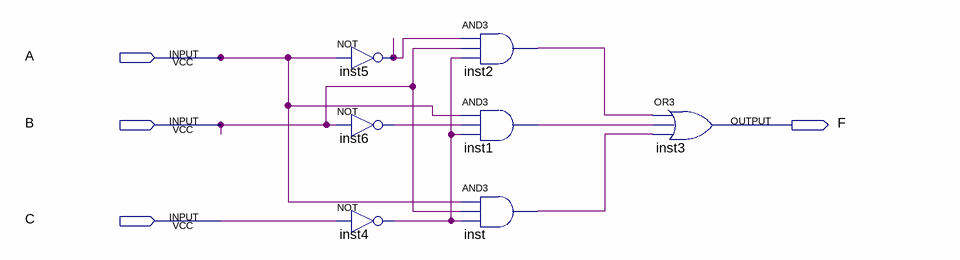
[diagram p0: schematic sheet]
// Quartus schematic lab2step1.bdf as structural Verilog: 7 symbols, 4 pins
module lab2step1 (
  input  A,
  input  B,
  input  C,
  output F
);

  wire inst1_out, inst2_out, inst4_out, inst5_out, inst6_out, inst_out;

  not inst5 (inst5_out, A);
  not inst6 (inst6_out, B);
  not inst4 (inst4_out, C);
  and inst2 (inst2_out, inst5_out, B, inst4_out);
  and inst1 (inst1_out, A, inst6_out, inst4_out);
  and inst (inst_out, A, B, inst4_out);
  or inst3 (F, inst2_out, inst1_out, inst_out);
endmodule
